# Altium schematic sheet B2B_1.SchDoc: RFSOC_SAWG
size 420 x 297 mm; Author: G.Kasprowicz; CompanyName: WUT ISE; DrawnBy: G.Kasprowicz; Organization: WUT ISE; Address1: PW ISE; Address2: Nowowiejska 15/19 00-665 Warsaw; Address3: gkasprow@gmail.com; DocumentNumber: 10; Revision: 1; SheetNumber: 10; SheetTotal: 20; ModifiedBy: -; CheckedDate: -; Title2: B2B 1; DivGrp: WUT ISE; Designer: G.Kasprowicz; ModifiedDate: -; ProjectName: Sensor Box
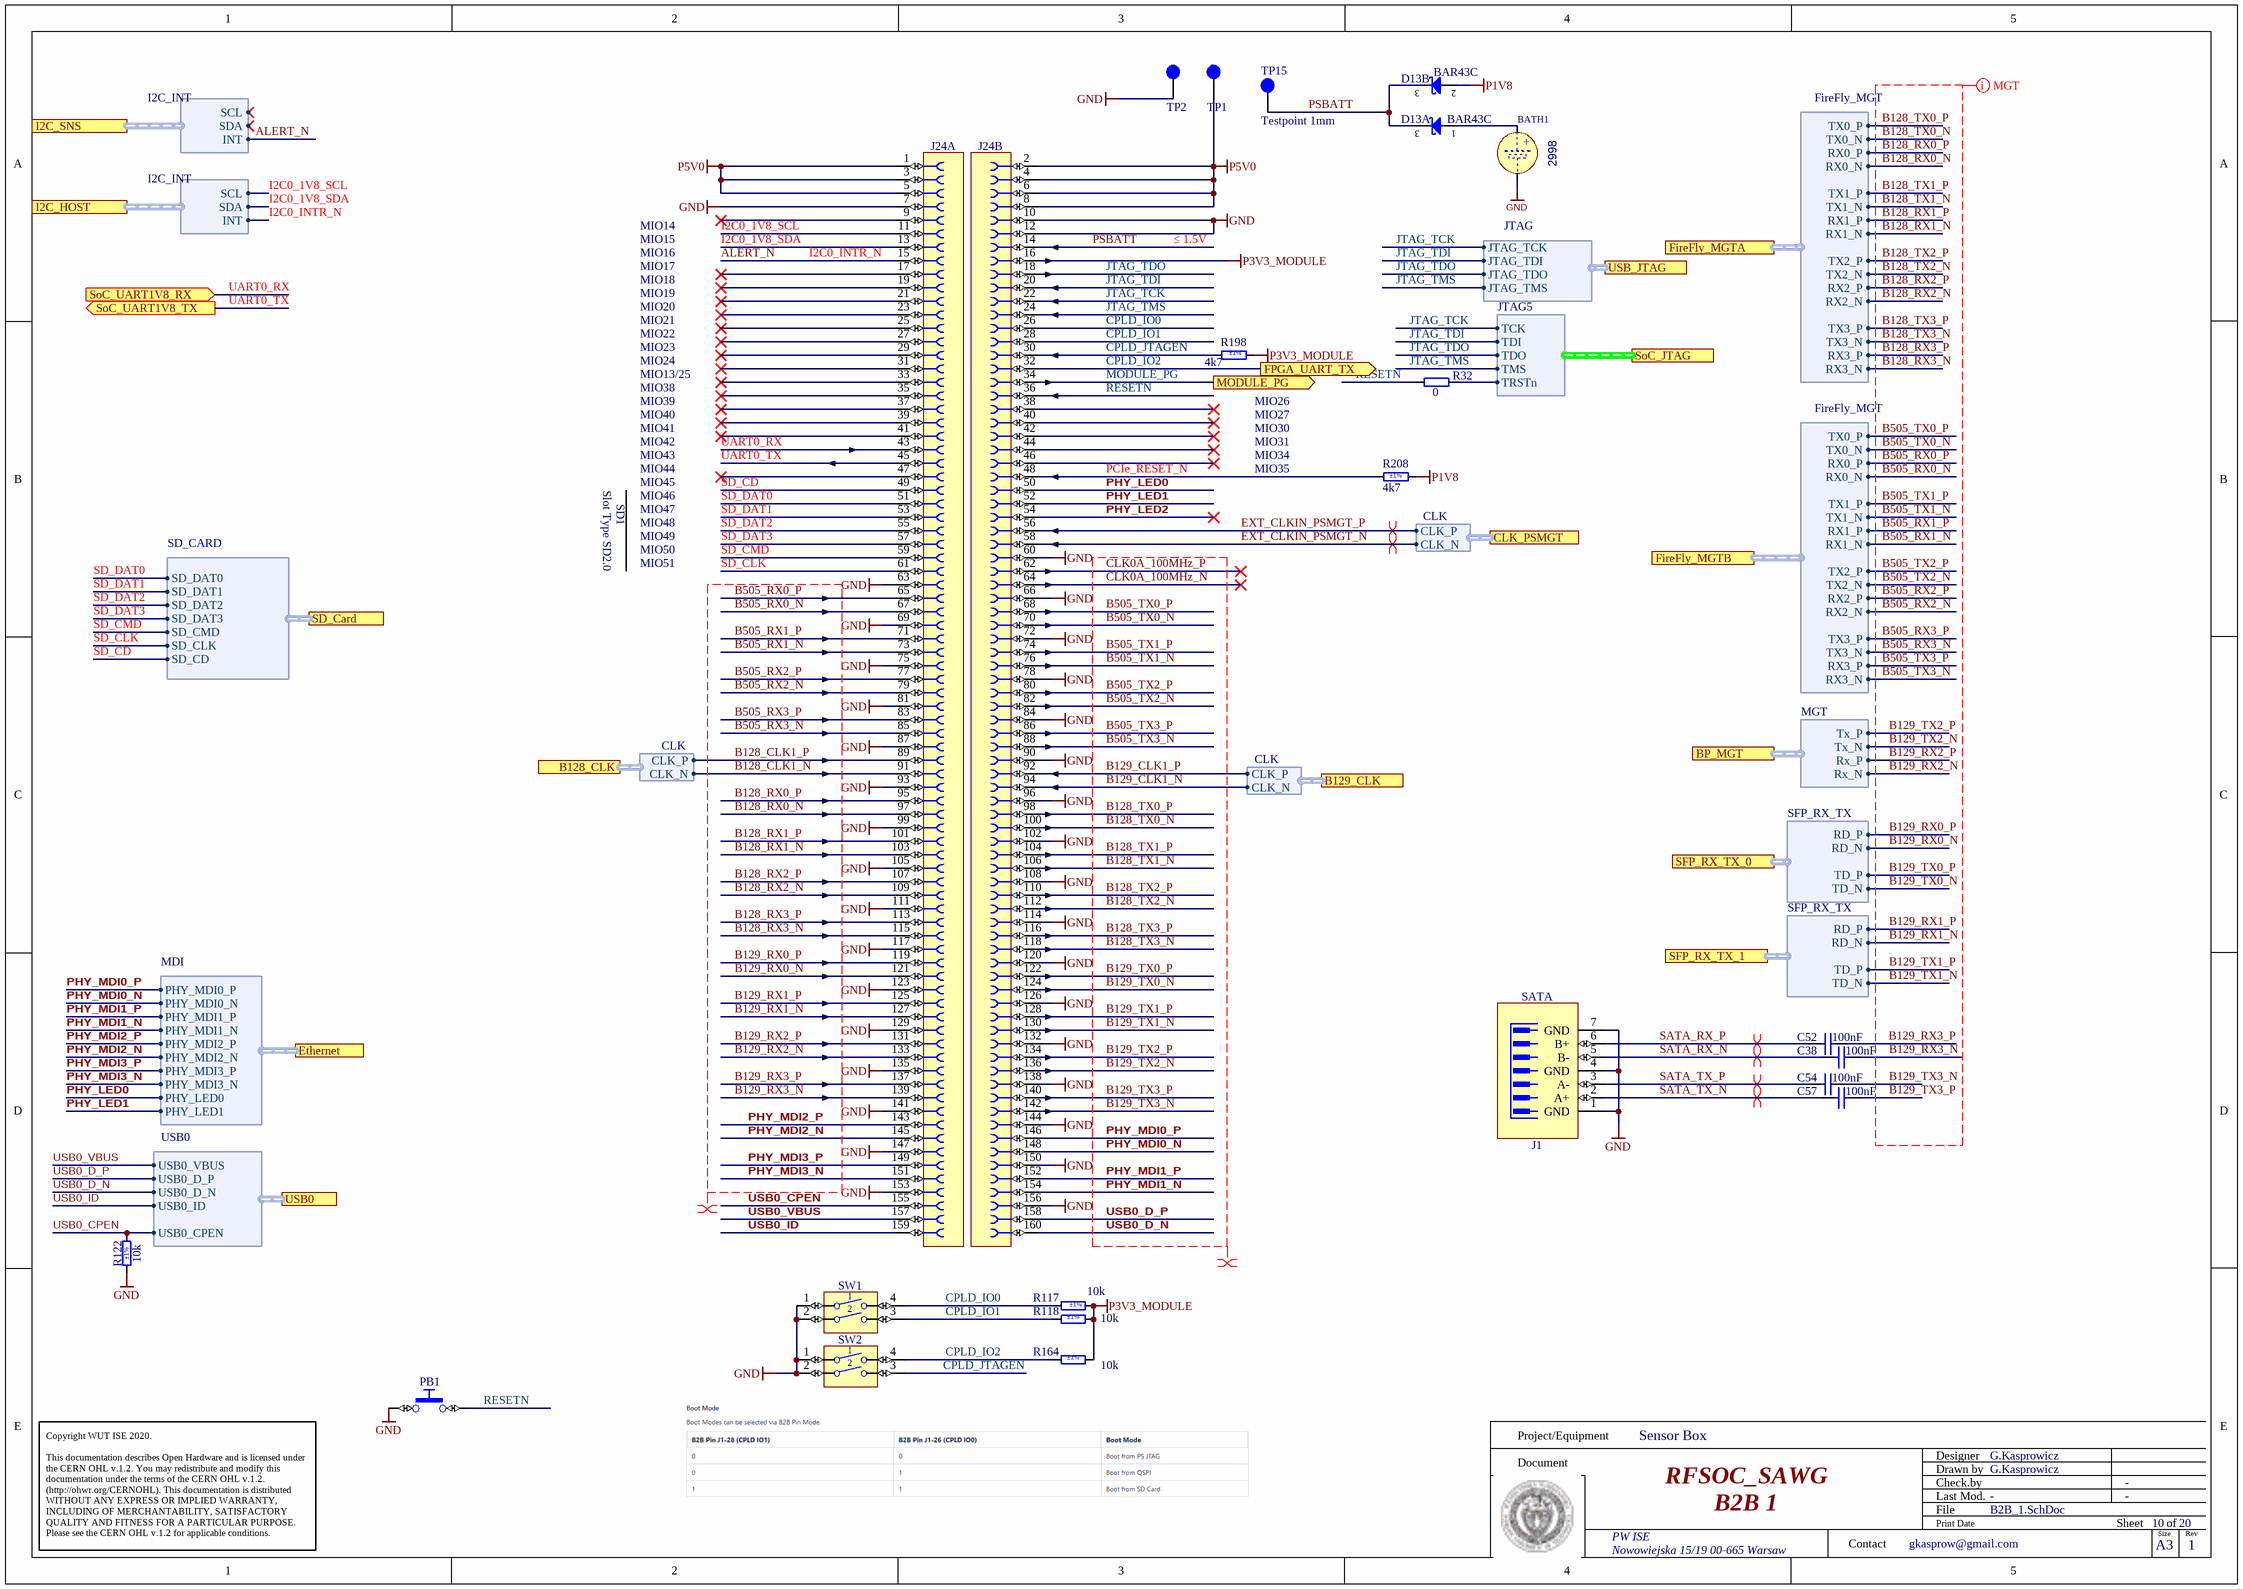
[diagram p0: B2B_1.SchDoc]

## Parts
BATH1  Manufacturer Part Number: 2998  [BATH_KEYSTONE_2998]
C38  100nF  [CAPC0603X33N]
C52  100nF  [CAPC0603X33N]
C54  100nF  [CAPC0603X33N]
C57  100nF  [CAPC0603X33N]
D13  BAR43C  [SOT95P240X130-3N]  (parts A,B of 2)
J1  SATA  [MOLEX_67800-5005]
J24  Socket 160  [SAMTEC_SS5-80-3.00-L-D-K]  (value not drawn)  (parts A,B of 2)
PB1  Push Button  [PB_TYCO_FSMSM]  (value not drawn)
R32  0  [RESC1005X40N]
R117  10k  Tolerance: ±1%  [RESC1005X40N]
R118  10k  Tolerance: ±1%  [RESC1005X40N]
R122  10k  Tolerance: ±1%  [RESC1005X40N]
R164  10k  Tolerance: ±1%  [RESC1005X40N]
R198  4k7  Tolerance: ±1%  [RESC1005X40N]
R208  4k7  Tolerance: ±1%  [RESC1005X40N]
SW1  Switch  [SW_OMRON_A6H-2102]  (value not drawn)
SW2  Switch  [SW_OMRON_A6H-2102]  (value not drawn)
TP1  Testpoint 0.8mm  [TP_0.8mm]  (value not drawn)  (no BOM)
TP2  Testpoint 0.8mm  [TP_0.8mm]  (value not drawn)  (no BOM)
TP15  Testpoint 1mm  [TP_1mm]  (no BOM)

## Ports
B128_CLK (harness CLK), B129_CLK (harness CLK), BP_MGT (harness MGT), CLK_PSMGT (harness CLK), Ethernet (harness MDI), FireFly_MGTA (harness FireFly_MGT), FireFly_MGTB (harness FireFly_MGT), FPGA_UART_TX (out), I2C_HOST (harness I2C_INT), I2C_SNS (harness I2C_INT), MODULE_PG (out), SD_Card (harness SD_CARD), SFP_RX_TX_0 (harness SFP_RX_TX), SFP_RX_TX_1 (harness SFP_RX_TX), SoC_JTAG (harness JTAG5), SoC_UART1V8_RX (in), SoC_UART1V8_TX (out), USB0 (harness USB0), USB_JTAG (harness JTAG)

## Harnesses
FireFly_MGT: RX1_P, RX1_N, RX2_P, RX2_N, RX3_P, RX3_N, RX0_P, RX0_N, TX1_P, TX1_N, TX2_P, TX2_N, TX3_P, TX3_N, TX0_P, TX0_N
SD_CARD: SD_DAT0, SD_DAT1, SD_DAT2, SD_DAT3, SD_CMD, SD_CLK, SD_CD
I2C_INT: SDA, SCL, INT
USB0: USB0_VBUS, USB0_D_P, USB0_D_N, USB0_ID, USB0_CPEN
MDI: PHY_MDI0_N, PHY_MDI1_P, PHY_MDI1_N, PHY_MDI2_P, PHY_MDI2_N, PHY_MDI3_P, PHY_MDI3_N, PHY_LED0, PHY_LED1, PHY_MDI0_P
CLK: CLK_P, CLK_N
JTAG5: TCK, TDI, TDO, TMS, TRSTn
MGT: Tx_P, Tx_N, Rx_P, Rx_N
SFP_RX_TX: RD_P, RD_N, TD_P, TD_N
JTAG: JTAG_TCK, JTAG_TDI, JTAG_TDO, JTAG_TMS

## Nets
GND: BATH1.2(MINUS) J1.1(GND) J1.4(GND) J1.7(GND) J24.7 J24.10 J24.12 J24.60 J24.63 J24.66 J24.69 J24.72 J24.75 J24.78 J24.81 J24.84 J24.87 J24.90 J24.93 J24.96 J24.99 J24.102 J24.105 J24.108 J24.111 J24.114 J24.117 J24.120 J24.123 J24.126 J24.129 J24.132 J24.135 J24.138 J24.141 J24.144 J24.147 J24.150 J24.153 J24.156 PB1.1 R122.1 SW1.1 SW1.2 SW2.1 SW2.2 TP2.1
P1V8: D13.2(A) R208.1
P3V3_MODULE: J24.16 R117.2 R118.2 R164.2 R198.1
P5V0: J24.1 J24.2 J24.3 J24.4 J24.5 J24.6 J24.8 TP1.1
ALERT_N: J24.15 ; port I2C_HOST.INT, port I2C_SNS.INT  [also labelled I2C0_INTR_N]
B128_CLK1_N: J24.91 ; port B128_CLK.CLK_N
B128_CLK1_P: J24.89 ; port B128_CLK.CLK_P
B128_RX0_N: J24.97 ; port FireFly_MGTA.RX0_N
B128_RX0_P: J24.95 ; port FireFly_MGTA.RX0_P
B128_RX1_N: J24.103 ; port FireFly_MGTA.RX1_N
B128_RX1_P: J24.101 ; port FireFly_MGTA.RX1_P
B128_RX2_N: J24.109 ; port FireFly_MGTA.RX2_N
B128_RX2_P: J24.107 ; port FireFly_MGTA.RX2_P
B128_RX3_N: J24.115 ; port FireFly_MGTA.RX3_N
B128_RX3_P: J24.113 ; port FireFly_MGTA.RX3_P
B128_TX0_N: J24.100 ; port FireFly_MGTA.TX0_N
B128_TX0_P: J24.98 ; port FireFly_MGTA.TX0_P
B128_TX1_N: J24.106 ; port FireFly_MGTA.TX1_N
B128_TX1_P: J24.104 ; port FireFly_MGTA.TX1_P
B128_TX2_N: J24.112 ; port FireFly_MGTA.TX2_N
B128_TX2_P: J24.110 ; port FireFly_MGTA.TX2_P
B128_TX3_N: J24.118 ; port FireFly_MGTA.TX3_N
B128_TX3_P: J24.116 ; port FireFly_MGTA.TX3_P
B129_CLK1_N: J24.94 ; port B129_CLK.CLK_N
B129_CLK1_P: J24.92 ; port B129_CLK.CLK_P
B129_RX0_N: J24.121 ; port SFP_RX_TX_0.RD_N
B129_RX0_P: J24.119 ; port SFP_RX_TX_0.RD_P
B129_RX1_N: J24.127 ; port SFP_RX_TX_1.RD_N
B129_RX1_P: J24.125 ; port SFP_RX_TX_1.RD_P
B129_RX2_N: J24.133 ; port BP_MGT.Rx_N
B129_RX2_P: J24.131 ; port BP_MGT.Rx_P
B129_RX3_N: C38.2 J24.139
B129_RX3_P: C52.2 J24.137
B129_TX0_N: J24.124 ; port SFP_RX_TX_0.TD_N
B129_TX0_P: J24.122 ; port SFP_RX_TX_0.TD_P
B129_TX1_N: J24.130 ; port SFP_RX_TX_1.TD_N
B129_TX1_P: J24.128 ; port SFP_RX_TX_1.TD_P
B129_TX2_N: J24.136 ; port BP_MGT.Tx_N
B129_TX2_P: J24.134 ; port BP_MGT.Tx_P
B129_TX3_N: C54.2 J24.142
B129_TX3_P: C57.2 J24.140
B505_RX0_N: J24.67 ; port FireFly_MGTB.RX0_N
B505_RX0_P: J24.65 ; port FireFly_MGTB.RX0_P
B505_RX1_N: J24.73 ; port FireFly_MGTB.RX1_N
B505_RX1_P: J24.71 ; port FireFly_MGTB.RX1_P
B505_RX2_N: J24.79 ; port FireFly_MGTB.RX2_N
B505_RX2_P: J24.77 ; port FireFly_MGTB.RX2_P
B505_RX3_N: J24.85 ; port FireFly_MGTB.TX3_N
B505_RX3_P: J24.83 ; port FireFly_MGTB.TX3_P
B505_TX0_N: J24.70 ; port FireFly_MGTB.TX0_N
B505_TX0_P: J24.68 ; port FireFly_MGTB.TX0_P
B505_TX1_N: J24.76 ; port FireFly_MGTB.TX1_N
B505_TX1_P: J24.74 ; port FireFly_MGTB.TX1_P
B505_TX2_N: J24.82 ; port FireFly_MGTB.TX2_N
B505_TX2_P: J24.80 ; port FireFly_MGTB.TX2_P
B505_TX3_N: J24.88 ; port FireFly_MGTB.RX3_N
B505_TX3_P: J24.86 ; port FireFly_MGTB.RX3_P
CLK0A_100MHz_N: J24.64
CLK0A_100MHz_P: J24.62
CPLD_IO0: J24.26 R117.1 SW1.4
CPLD_IO1: J24.28 R118.1 SW1.3
CPLD_IO2: J24.32 R164.1 SW2.4 ; port FPGA_UART_TX
CPLD_JTAGEN: J24.30 R198.2 SW2.3
EXT_CLKIN_PSMGT_N: J24.58 ; port CLK_PSMGT.CLK_N
EXT_CLKIN_PSMGT_P: J24.56 ; port CLK_PSMGT.CLK_P
I2C0_1V8_SCL: J24.11 ; port I2C_HOST.SCL
I2C0_1V8_SDA: J24.13 ; port I2C_HOST.SDA
JTAG_TCK: J24.22 ; port SoC_JTAG.TCK, port USB_JTAG.JTAG_TCK
JTAG_TDI: J24.20 ; port SoC_JTAG.TDI, port USB_JTAG.JTAG_TDI
JTAG_TDO: J24.18 ; port SoC_JTAG.TDO, port USB_JTAG.JTAG_TDO
JTAG_TMS: J24.24 ; port SoC_JTAG.TMS, port USB_JTAG.JTAG_TMS
MODULE_PG: J24.34 ; port MODULE_PG
PCIe_RESET_N: J24.48 R208.2
PHY_LED0: J24.50 ; port Ethernet.PHY_LED0
PHY_LED1: J24.52 ; port Ethernet.PHY_LED1
PHY_LED2: J24.54
PHY_MDI0_N: J24.148 ; port Ethernet.PHY_MDI0_N
PHY_MDI0_P: J24.146 ; port Ethernet.PHY_MDI0_P
PHY_MDI1_N: J24.154 ; port Ethernet.PHY_MDI1_N
PHY_MDI1_P: J24.152 ; port Ethernet.PHY_MDI1_P
PHY_MDI2_N: J24.145 ; port Ethernet.PHY_MDI2_N
PHY_MDI2_P: J24.143 ; port Ethernet.PHY_MDI2_P
PHY_MDI3_N: J24.151 ; port Ethernet.PHY_MDI3_N
PHY_MDI3_P: J24.149 ; port Ethernet.PHY_MDI3_P
PSBATT: D13.3(COMC) J24.14 TP15.1
RESETN: J24.36 PB1.2 R32.1
SATA_RX_N: C38.1 J1.5(B-)
SATA_RX_P: C52.1 J1.6(B+)
SATA_TX_N: C57.1 J1.2(A+)
SATA_TX_P: C54.1 J1.3(A-)
SD_CD: J24.49 ; port SD_Card.SD_CD
SD_CLK: J24.61 ; port SD_Card.SD_CLK
SD_CMD: J24.59 ; port SD_Card.SD_CMD
SD_DAT0: J24.51 ; port SD_Card.SD_DAT0
SD_DAT1: J24.53 ; port SD_Card.SD_DAT1
SD_DAT2: J24.55 ; port SD_Card.SD_DAT2
SD_DAT3: J24.57 ; port SD_Card.SD_DAT3
UART0_RX: J24.43 ; port SoC_UART1V8_RX
UART0_TX: J24.45 ; port SoC_UART1V8_TX
USB0_CPEN: J24.155 R122.2 ; port USB0.USB0_CPEN
USB0_D_N: J24.160 ; port USB0.USB0_D_N
USB0_D_P: J24.158 ; port USB0.USB0_D_P
USB0_ID: J24.159 ; port USB0.USB0_ID
USB0_VBUS: J24.157 ; port USB0.USB0_VBUS
NetBATH1_1: BATH1.1(PLUS) D13.1(A)
NetR32_2: R32.2 ; port SoC_JTAG.TRSTn

Not connected (* = marked no-connect by the designer): J24 9* 17* 19* 21* 23* 25* 27* 29* 31* 33* 35* 37* 38* 39* 40* 41* 42* 44* 46* 47*

## Layout directives
differential pair: B128_CLK1_N, B128_CLK1_P, B128_RX0_N, B128_RX0_P, B128_RX1_N, B128_RX1_P, B128_RX2_N, B128_RX2_P, B128_RX3_N, B128_RX3_P, B128_TX0_N, B128_TX0_P, B128_TX1_N, B128_TX1_P, B128_TX2_N, B128_TX2_P, B128_TX3_N, B128_TX3_P, B129_CLK1_N, B129_CLK1_P, B129_RX0_N, B129_RX0_P, B129_RX1_N, B129_RX1_P, B129_RX2_N, B129_RX2_P, B129_RX3_N, B129_RX3_P, B129_TX0_N, B129_TX0_P, B129_TX1_N, B129_TX1_P, B129_TX2_N, B129_TX2_P, B129_TX3_N, B129_TX3_P, B505_RX0_N, B505_RX0_P, B505_RX1_N, B505_RX1_P, B505_RX2_N, B505_RX2_P, B505_RX3_N, B505_RX3_P, B505_TX0_N, B505_TX0_P, B505_TX1_N, B505_TX1_P, B505_TX2_N, B505_TX2_P, B505_TX3_N, B505_TX3_P, CLK0A_100MHz_N, CLK0A_100MHz_P, EXT_CLKIN_PSMGT_N, EXT_CLKIN_PSMGT_P, PHY_MDI0_N, PHY_MDI0_P, PHY_MDI1_N, PHY_MDI1_P, PHY_MDI2_N, PHY_MDI2_P, PHY_MDI3_N, PHY_MDI3_P, USB0_D_N, USB0_D_P
differential pair; net class Diff_100Ohm: SATA_RX_N, SATA_RX_P, SATA_TX_N, SATA_TX_P
net class MGT: B128_RX0_N, B128_RX0_P, B128_RX1_N, B128_RX1_P, B128_RX2_N, B128_RX2_P, B128_RX3_N, B128_RX3_P, B128_TX0_N, B128_TX0_P, B128_TX1_N, B128_TX1_P, B128_TX2_N, B128_TX2_P, B128_TX3_N, B128_TX3_P, B129_RX0_N, B129_RX0_P, B129_RX1_N, B129_RX1_P, B129_RX2_N, B129_RX2_P, B129_RX3_N, B129_RX3_P, B129_TX0_N, B129_TX0_P, B129_TX1_N, B129_TX1_P, B129_TX2_N, B129_TX2_P, B129_TX3_N, B129_TX3_P, B505_RX0_N, B505_RX0_P, B505_RX1_N, B505_RX1_P, B505_RX2_N, B505_RX2_P, B505_RX3_N, B505_RX3_P, B505_TX0_N, B505_TX0_P, B505_TX1_N, B505_TX1_P, B505_TX2_N, B505_TX2_P, B505_TX3_N, B505_TX3_P

## Notes on the sheet
- MIO14
- MIO15
- MIO16
- ≤ 1.5V
- MIO17
- MIO18
- MIO19
- MIO20
- MIO21
- MIO22
- MIO23
- MIO24
- MIO13/25
- MIO38
- MIO39
- MIO40
- MIO41
- MIO42
- MIO43
- (near R198) MIO26
- MIO27
- MIO30
- MIO31
- MIO34
- Slot Type SD2.0
- SD1
- MIO45
- MIO46
- MIO47
- MIO48
- MIO44
- MIO35
- MIO49
- MIO50
- MIO51
- Project/Equipment
- Document
- Designer
- Drawn by
- Check.by
- Copyright WUT ISE 2020.
  This documentation describes Open Hardware and is licensed under the CERN OHL v.1.2. You may redistribute and modify this documentation under the terms of the CERN OHL v.1.2. (http://ohwr.org/CERNOHL). This documentation is distributed WITHOUT ANY EXPRESS OR IMPLIED WARRANTY, INCLUDING OF MERCHANTABILITY, SATISFACTORY QUALITY AND FITNESS FOR A PARTICULAR PURPOSE. Please see the CERN OHL v.1.2 for applicable conditions.
- Contact
- File
- Last Mod.
- Print Date
- Sheet
- Size
- A3
- of
- Rev
- (in symbol BATH_KEYSTONE_2998) +

## Library data of the parts
BATH1 = BATH_KEYSTONE_2998: Battery Holder whit 2 Pin; Part Description: SMD Battery Holder for MC621, V364, SC621, DR13H, DR77, V13AT, 377 Button Cells; PressFit: No; Manufacturer: KEYSTONE; PackageDescription: SMD Battery Holder for MC621, V364, SC621, DR13H, DR77, V13AT, 377 Button Cells; Part Number: BATH_KEYSTONE_2998; Component Kind: Standard; Component Type: Standard; Pin Count: 3; Family: Battery; Mounted: Yes; Socket: No; SMD: Yes; Sense: No; ComponentHeight: 3.048mm; HelpURL: \\cern.ch\dfs\Applications\Altium\Datasheets\BATH_KEYSTONE_2998.pdf; Author: CERN DEM JLC; CreateDate: 03.07.2014; LatestRevisionDate: 07.06.2017
C38 C52 C54 C57 = CC0201_100NF_6.3V_10%_X5R: Non-polarised capacitor; Part Description: SMD Multilayer Chip Ceramic Capacitor; Manufacturer: GENERIC; Manufacturer1 Part Number: 02016D104KAT2A; Voltage: 6.3V; TC: X5R; Tolerance: ±10%; Part Number: CC0201_100NF_6.3V_10%_X5R; Component Kind: Standard; Component Type: Standard; Pin Count: 2; Value: 100nF; Status: Not Recommended; Manufacturer Part Number: CC0201_100NF_6.3V_10%_X5R; Case: 0201; Mounted: Yes; Socket: No; SMD: Yes; Sense: No; Manufacturer1 Example: AVX; Manufacturer1 ComponentHeight: 0.33mm; HelpURL: \\cern.ch\dfs\Applications\Altium\Datasheets\CC0201_X5R_AVX.pdf; Author: CERN DEM JLC; CreateDate: 2007-12-03; LatestRevisionDate: 2007-12-03; ClassName: SATA
D13 = BAR43C: Dual Common Cathode Schottky Diodes; Manufacturer: FAIRCHILD SEMICONDUCTOR; Voltage: 30V; Power: 200mA; PressFit: No; Bonding: No; Part Number: BAR43C; Component Kind: Standard; Component Type: Standard; Device: BAR43C; PackageDescription: SOT, 0.95mm Pitch; 3 Pin, 1.30mm W X 2.90mm L X 1.30mm H body, IPC Medium Density; Part Description: Dual Common Cathode Schottky Diode; Manufacturer Part Number: BAR43C; Pin Count: 3; Case: SOT23-3; Mounted: Yes; Socket: No; SMD: Yes; Sense: No; ComponentHeight: 1.30mm; HelpURL: \\cern.ch\dfs\Applications\Altium\Datasheets\BAR43C.pdf; Author: CERN DEM JLC; CreateDate: 27.05.2010; LatestRevisionDate: 27.05.2010
J1 = MOLEX_67800-5005: 7 Pin SATA Receptacle; Part Description: 1.27mm Pitch, 7 Contacts, Serial ATA High Speed Header, Straight with Locking Latch; Manufacturer: MOLEX; PressFit: No; Part Number: MOLEX_67800-5005; Component Kind: Standard; Component Type: Standard; Pin Count: 7; Family: SATA; Mounted: Yes; Socket: No; SMD: Yes; Sense: No; Status: None; Manufacturer Part Number: 67800-5005; ComponentHeight: 8.4mm; HelpURL: \\cern.ch\dfs\Applications\Altium\Datasheets\MOLEX_67800-5005.pdf; Author: CERN DEM MR; CreateDate: 01.12.2016; LatestRevisionDate: 01.12.2016; ClassName: SATA
J24 = SAMTEC_SS5-80-3.00-L-D-K: Connector 160 Female; Part Description: 160 Contacts, Pitch 0.50 mm Micro Blade & Beam Low-Profile Socket; Manufacturer: SAMTEC; PressFit: No; Part Number: SAMTEC_SS5-80-3.00-L-D-K; Component Kind: Standard; Component Type: Standard; Pin Count: 160; Family: Socket 160; Mounted: Yes; Socket: No; SMD: Yes; Sense: No; Status: None; Manufacturer Part Number: SS5-80-3.00-L-D-K; ComponentHeight: 4mm; HelpURL: \\cern.ch\dfs\Applications\Altium\Datasheets\SAMTEC_SS5-80-3.00-L-D-K.pdf; Author: CERN DEM BC; CreateDate: 11.08.2021; LatestRevisionDate: 11.08.2021
PB1 = PB_TYCO_FSMSM: Push-Button Switch SPDT; Part Description: 12VDC 50mA SPST Tactile  Push-Button Switch; Manufacturer: TYCO ELECTRONICS; Manufacturer Part Number: FSMSM or 1437566-3; PressFit: No; Part Number: PB_TYCO_FSMSM; Component Kind: Standard; Component Type: Standard; Pin Count: 2; PackageDescription: Body 3.5x6.0mm, Pushbutton Switch,  TYCO ALCOSWITCH FSMSM Serie; Family: Push Button; Mounted: Yes; Socket: No; SMD: Yes; Sense: No; Status: None; ComponentHeight: 4.3mm; HelpURL: \\cern.ch\dfs\Applications\Altium\Datasheets\PB_TYCO_FSMSM.pdf; Author: CERN DEM JLC; CreateDate: 30.06.2008; LatestRevisionDate: 21.06.2012
R32 = R0402_0R_JUMPER: Resistor; Part Description: 1A (0.05R Max DC Resistance) Zero Ohm Jumper; Manufacturer: GENERIC; Manufacturer1 Part Number: 232270591001L; PressFit: No; Part Number: R0402_0R_JUMPER; Component Kind: Standard; Component Type: Standard; Pin Count: 2; Value: 0; Status: Not Recommended; Manufacturer Part Number: R0402_0R_JUMPER; Case: 0402; Mounted: Yes; Sense: No; Socket: No; SMD: Yes; Manufacturer1 Example: YAGEO PHYCOMP; Manufacturer1 ComponentHeight: 0.4mm; HelpURL: \\cern.ch\dfs\Applications\Altium\Datasheets\R0402_Phycomp_RC0402.pdf; Author: CERN DEM JLC; CreateDate: 03.12.2007; LatestRevisionDate: 17.10.2012
R117 R118 R122 R164 = R0402_10K_1%_0.0625W_100PPM: Resistor - 1%; Part Description: General Purpose Thick Film Chip Resistor; Manufacturer: GENERIC; Manufacturer1 Part Number: 232270671003L; TC: ±100ppm/°C; PressFit: No; Case: 0402; Value: 10k; Part Number: R0402_10K_1%_0.0625W_100PPM; Component Kind: Standard; Component Type: Standard; Pin Count: 2; Status: Not Recommended; Power: 0.0625W; Manufacturer Part Number: R0402_10K_1%_0.0625W_100PPM; Mounted: Yes; Sense: No; Socket: No; SMD: Yes; Manufacturer1 Example: YAGEO PHYCOMP; Manufacturer1 ComponentHeight: 0.4mm; HelpURL: \\cern.ch\dfs\Applications\Altium\Datasheets\R0402_Phycomp_RC0402.pdf; Author: CERN DEM JLC; CreateDate: 03.12.2007; LatestRevisionDate: 17.10.2012
R198 R208 = R0402_4K7_1%_0.0625W_100PPM: Resistor - 1%; Part Description: General Purpose Thick Film Chip Resistor; Manufacturer: GENERIC; Manufacturer1 Part Number: 232270674702L; TC: ±100ppm/°C; PressFit: No; Case: 0402; Value: 4k7; Part Number: R0402_4K7_1%_0.0625W_100PPM; Component Kind: Standard; Component Type: Standard; Pin Count: 2; Status: Not Recommended; Power: 0.0625W; Manufacturer Part Number: R0402_4K7_1%_0.0625W_100PPM; Mounted: Yes; Sense: No; Socket: No; SMD: Yes; Manufacturer1 Example: YAGEO PHYCOMP; Manufacturer1 ComponentHeight: 0.4mm; HelpURL: \\cern.ch\dfs\Applications\Altium\Datasheets\R0402_Phycomp_RC0402.pdf; Author: CERN DEM JLC; CreateDate: 03.12.2007; LatestRevisionDate: 17.10.2012
SW1 SW2 = SW_OMRON_A6H-2102: 2 Ways SPST DIP Switch; Part Description: 2 Ways Ultra-low Profile, Half-pitch, SPST DIP Switch With Seal Tape, Rating 25mA 24VDC; Manufacturer: OMRON; PressFit: No; Part Number: SW_OMRON_A6H-2102; Component Kind: Standard; Component Type: Standard; Pin Count: 4; PackageDescription: Pitch 1.27mm, Body 3.77 x 4.5mm, 2 Ways SPST Surface-Mounting DIP Switch, OMRON A6H; Family: Switch; Mounted: Yes; Socket: No; SMD: Yes; Sense: No; Status: None; Manufacturer Part Number: A6H-2102; ComponentHeight: 1.45mm; HelpURL: \\cern.ch\dfs\Applications\Altium\Datasheets\SW_OMRON_A6H-2102.pdf; Author: CERN DEM BC; CreateDate: 18.08.2021; LatestRevisionDate: 18.08.2021
TP1 TP2 = 26289: AN: 26289; Mixed: MECH
TP15 = 25063: AN: 25063; Mixed: SMT